# EAGLE design Speed Bag Counter-v10 (EAGLE 6.3)
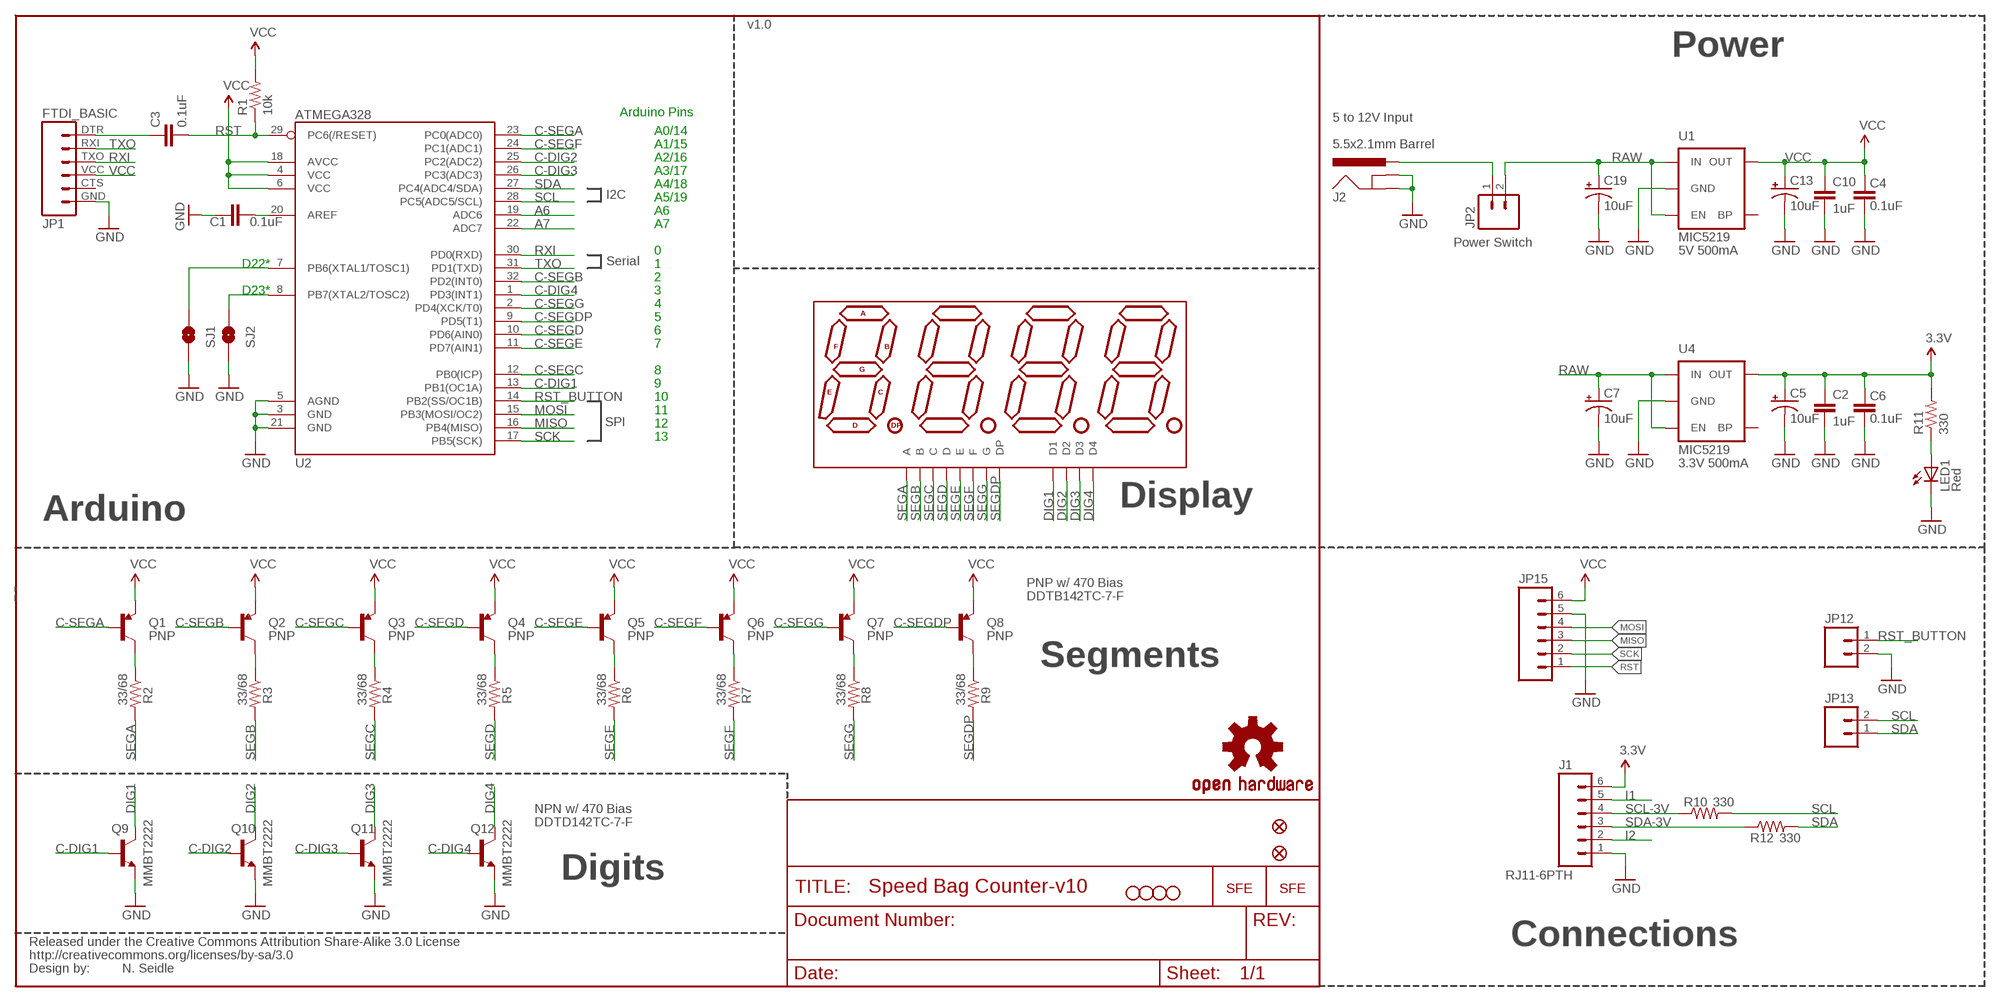
[diagram p0: schematic, sheet 1]

## Parts
C1  0.1uF  CAP0402-CAP  [0402-CAP]
C2  1uF  CAP0402-CAP  [0402-CAP]
C3  0.1uF  CAP0402-CAP  [0402-CAP]
C4  0.1uF  CAP0402-CAP  [0402-CAP]
C5  10uF  CAP_POL1206  [EIA3216]
C6  0.1uF  CAP0402-CAP  [0402-CAP]
C7  10uF  CAP_POL1206  [EIA3216]
C10  1uF  CAP0402-CAP  [0402-CAP]
C13  10uF  CAP_POL1206  [EIA3216]
C19  10uF  CAP_POL1206  [EIA3216]
J1  RJ11-6PTH  [RJ11-6]
J2  5.5x2.1mm Barrel  POWER_JACKSMD  [POWER_JACK_SMD]
JP1  FTDI_BASIC  FTDI_BASICPTH  [FTDI_BASIC]
JP2  M02-JST-2MM-SMT  [JST-2-SMD]
JP3  STAND-OFF  [STAND-OFF]
JP4  STAND-OFF  [STAND-OFF]
JP5  STAND-OFF  [STAND-OFF]
JP6  STAND-OFF  [STAND-OFF]
JP7  FIDUCIALUFIDUCIAL  [MICRO-FIDUCIAL]
JP12  M02-JST-2MM-SMT  [JST-2-SMD]
JP13  M02PTH  [1X02]
JP14  FIDUCIALUFIDUCIAL  [MICRO-FIDUCIAL]
JP15  M06SIP  [1X06]
LED1  Red  LED0603  [LED-0603]
Q1  PNP  TRANSISTOR_PNPSMD  [SOT23-3]
Q2  PNP  TRANSISTOR_PNPSMD  [SOT23-3]
Q3  PNP  TRANSISTOR_PNPSMD  [SOT23-3]
Q4  PNP  TRANSISTOR_PNPSMD  [SOT23-3]
Q5  PNP  TRANSISTOR_PNPSMD  [SOT23-3]
Q6  PNP  TRANSISTOR_PNPSMD  [SOT23-3]
Q7  PNP  TRANSISTOR_PNPSMD  [SOT23-3]
Q8  PNP  TRANSISTOR_PNPSMD  [SOT23-3]
Q9  MMBT2222  TRANSISTOR_NPNSOT23-3  [SOT23-3]
Q10  MMBT2222  TRANSISTOR_NPNSOT23-3  [SOT23-3]
Q11  MMBT2222  TRANSISTOR_NPNSOT23-3  [SOT23-3]
Q12  MMBT2222  TRANSISTOR_NPNSOT23-3  [SOT23-3]
R1  10k  RESISTOR0402-RES  [0402-RES]
R2  33/68  RESISTOR0402-RES  [0402-RES]
R3  33/68  RESISTOR0402-RES  [0402-RES]
R4  33/68  RESISTOR0402-RES  [0402-RES]
R5  33/68  RESISTOR0402-RES  [0402-RES]
R6  33/68  RESISTOR0402-RES  [0402-RES]
R7  33/68  RESISTOR0402-RES  [0402-RES]
R8  33/68  RESISTOR0402-RES  [0402-RES]
R9  33/68  RESISTOR0402-RES  [0402-RES]
R10  330  RESISTOR0402-RES  [0402-RES]
R11  330  RESISTOR0402-RES  [0402-RES]
R12  330  RESISTOR0402-RES  [0402-RES]
SJ1  Counter Ctl  SOLDERJUMPERNO  [SJ_2S-NO]
SJ2  Counter Ctl  SOLDERJUMPERNO  [SJ_2S-NO]
U1  MIC5219  V_REG_LDOSMD  [SOT23-5]
U2  ATMEGA328  ATMEGA168  [TQFP32-08]
U3  7-SEGMENT-4DIGIT-COUNTERPTH  [7-SEGMENT-4DIGIT-COUNTER]
U4  MIC5219  V_REG_LDOSMD  [SOT23-5]
U$2  LOGO-SFESK  [SFE-LOGO-FLAME]
U$3  CREATIVE_COMMONS  [CREATIVE_COMMONS]
U$4  OSHW-LOGOS  [OSHW-LOGO-S]
U$7  LOGO-SFENW2  [SFE-NEW-WEB]

## Nets
3.3V: C2.1 C5.A(+) C6.2 J1.6 R11.2 U4.5(OUT)
A6: U2.19(ADC6)
A7: U2.22(ADC7)
ANALOG: SJ2.1 U2.8(PB7(XTAL2/TOSC2))
C-DIG1: Q9.1(B) U2.13(PB1(OC1A))
C-DIG2: Q10.1(B) U2.25(PC2(ADC2))
C-DIG3: Q11.1(B) U2.26(PC3(ADC3))
C-DIG4: Q12.1(B) U2.1(PD3(INT1))
C-SEGA: Q1.1(B) U2.23(PC0(ADC0))
C-SEGB: Q2.1(B) U2.32(PD2(INT0))
C-SEGC: Q3.1(B) U2.12(PB0(ICP))
C-SEGD: Q4.1(B) U2.10(PD6(AIN0))
C-SEGDP: Q8.1(B) U2.9(PD5(T1))
C-SEGE: Q5.1(B) U2.11(PD7(AIN1))
C-SEGF: Q6.1(B) U2.24(PC1(ADC1))
C-SEGG: Q7.1(B) U2.2(PD4(XCK/T0))
COUNTER: SJ1.1 U2.7(PB6(XTAL1/TOSC1))
DIG1: Q9.3(C) U3.12(D1)
DIG2: Q10.3(C) U3.9(D2)
DIG3: Q11.3(C) U3.8(D3)
DIG4: Q12.3(C) U3.6(D4)
GND: C1.1 C2.2 C4.1 C5.C(-) C6.1 C7.C(-) C10.2 C13.C(-) C19.C(-) J1.1 J2.GND(GNDBREAK) J2.P$4(GND) JP1.GND JP12.2 JP15.5 LED1.C Q9.2(E) Q10.2(E) Q11.2(E) Q12.2(E) SJ1.2 SJ2.2 U1.2(GND) U2.3(GND) U2.5(AGND) U2.21(GND) U4.2(GND)
I1: J1.5
I2: J1.2
MISO: JP15.3 U2.16(PB4(MISO))
MOSI: JP15.4 U2.15(PB3(MOSI/OC2))
N$1: Q1.3(C) R2.1
N$2: J2.VIN0(PWR) JP2.1
N$3: C3.1 JP1.DTR
N$4: Q2.3(C) R3.1
N$5: Q3.3(C) R4.1
N$6: Q4.3(C) R5.1
N$7: Q5.3(C) R6.1
N$8: Q6.3(C) R7.1
N$9: Q7.3(C) R8.1
N$10: Q8.3(C) R9.1
N$11: C1.2 U2.20(AREF)
N$38: LED1.A R11.1
RAW [vcc]: C7.A(+) C19.A(+) JP2.2 U1.1(IN) U1.3(EN) U4.1(IN) U4.3(EN)
RST: C3.2 JP15.1 R1.1 U2.29(PC6(/RESET))
RST_BUTTON: JP12.1 U2.14(PB2(SS/OC1B))
RXI: JP1.TXO U2.30(PD0(RXD))
SCK: JP15.2 U2.17(PB5(SCK))
SCL: JP13.2 R10.2 U2.28(PC5(ADC5/SCL))
SCL-3V: J1.4 R10.1
SDA: JP13.1 R12.2 U2.27(PC4(ADC4/SDA))
SDA-3V: J1.3 R12.1
SEGA: R2.2 U3.11(A)
SEGB: R3.2 U3.7(B)
SEGC: R4.2 U3.4(C)
SEGD: R5.2 U3.2(D)
SEGDP: R9.2 U3.3(DP)
SEGE: R6.2 U3.1(E)
SEGF: R7.2 U3.10(F)
SEGG: R8.2 U3.5(G)
TXO: JP1.RXI U2.31(PD1(TXD))
VCC: C4.2 C10.1 C13.A(+) JP1.VCC JP15.6 Q1.2(E) Q2.2(E) Q3.2(E) Q4.2(E) Q5.2(E) Q6.2(E) Q7.2(E) Q8.2(E) R1.2 U1.5(OUT) U2.4(VCC) U2.6(VCC) U2.18(AVCC)
Unconnected: JP1.CTS U1.4(BP) U4.4(BP)

## Notes on the sheet
- v1.0
- Power
- Arduino Pins
- 5 to 12V Input
- A0/14
- A1/15
- A2/16
- A3/17
- A4/18
- I2C | A5/19
- A6
- A7
- Power Switch
- 0 | 5V 500mA
- D22* | Serial | 1
- 2
- D23* | 3
- 4
- 5
- 6
- 7
- 8
- 9
- 10
- 11
- SPI | 12
- 13
- 3.3V 500mA
- Display
- Arduino
- PNP w/ 470 Bias
- DDTB142TC-7-F
- Segments
- NPN w/ 470 Bias
- DDTD142TC-7-F
- Digits
- Connections
- N. Seidle

## Library data of the parts
C1-C4 C6 C10 = SparkFun:CAP: Capacitor Standard 0603 ceramic capacitor, and 0.1" leaded capacitor.
C5 C7 C13 C19 = SparkFun:CAP_POL: Capacitor Polarized These are standard SMD and PTH capacitors. Normally 10uF, 47uF, and 100uF in electrolytic and tantalum varieties. Always verify the external diameter of the through hole cap, it varies with capacity, voltage, and manufacturer. The EIA devices should be standard.
J1 = SparkFun-Connectors:RJ11-6: RJ11 Jack Simple 6 pin RJ11 jack. Commonly found on CAT3 devices and Microchip programmers. SKU: PRT-00132
J2 = SparkFun-Connectors:POWER_JACK: Power Jack This is the standard 5.5mm barrel jack for power. The PTH is the most common, proven, reliable, footprint. The Slot footprint only works if the mill layer is transmitted to the PCB fab house so be warned. Spark Fun Electronics SKU : PRT-00119 SMT: CONN-08106 Mating wall wart : TOL-00298 (and others); PROD_ID: CONN-08106
JP1 = SparkFun:FTDI_BASIC: FTDI Basic: 3.3V and 5V
JP2 JP12 JP13 = SparkFun-Connectors:M02: Header 2 Standard 2-pin 0.1" header. Use with straight break away headers (SKU : PRT-00116), right angle break away headers (PRT-00553), swiss pins (PRT-00743), machine pins (PRT-00117), and female headers (PRT-00115). Molex polarized connector foot print use with SKU : PRT-08233 with associated crimp pins and housings.
JP3-JP6 = SparkFun-Electromechanical:STAND-OFF: #4 Stand Off This is the mechanical footprint for a #4 phillips button head screw. Use the keepout ring to avoid running the screw head into surrounding components. SKU : PRT-00447
JP7 JP14 = SparkFun:FIDUCIAL: Fiducial Alignment Points Various fiducial points for machine vision alignment.
JP15 = SparkFun-Connectors:M06: Header 6 Standard 6-pin 0.1" header. Use with straight break away headers (SKU : PRT-00116), right angle break away headers (PRT-00553), swiss pins (PRT-00743), machine pins (PRT-00117), and female headers (PRT-00115). Molex polarized connector foot print use with SKU : PRT-08094 with associated crimp pins and housings. NOTES ON THE VARIANTS LOCK and LOCK_LONGPADS... This footprint was designed to help hold the alignment of a through-hole component (i.e. 6-pin header) while soldering it into place. You may notice that each hole has been shifted either up or down by 0.005 of an inch from it's more standard position (which is a perfectly straight line). This slight alteration caused the pins (the squares in the middle) to touch the edges of the holes. Because they are alternating, it causes a "brace" to hold the component in place. 0.005 has proven to be the perfect amount of "off-center" position when using our standard breakaway headers. Although looks a little odd when you look at the bare footprint, once you have a header in there, the alteration is very hard to notice. Also, if you push a header all the way into place, it is covered up entirely on the bottom side. This idea of altering the position of holes to aid alignment will be further integrated into the Sparkfun Library for other footprints. It can help hold any component with 3 or more connection pins.
LED1 = SparkFun:LED: LEDs Standard schematic elements and footprints for 5mm, 3mm, 1206, and 0603 sized LEDs. 5mm - Spark Fun Electronics SKU : COM-00529 (and others)
Q1-Q8 = SparkFun-DiscreteSemi:TRANSISTOR_PNP: Generic PNP BJT. Double check pinouts against datasheets- not all devices are the same!
Q9-Q12 = SparkFun-DiscreteSemi:TRANSISTOR_NPN: Generic NPN BJT. MMBT2222 is the common NPN we use. Double check against datasheet- not all devices are the same!
R1-R12 = SparkFun:RESISTOR: Resistor Basic schematic elements and footprints for 0603, 1206, and PTH resistors.
SJ1 SJ2 = SparkFun-Passives:SOLDERJUMPER: Solder Jumper Standard SMD solder jumper. Used to automate production. Two varients : Normally Open and Normally Closed are the same, but have different paste layers. NC will have a large amount of paste and should jumper during reflow.
U1 U4 = SparkFun:V_REG_LDO: Voltage Regulator LDO Standard 150mA LDO voltage regulator in SOT-23 layout. Micrel part MIC5205. BP (by-pass) pin is used to lower output noise with 470pF cap.
U2 = SparkFun-DigitalIC:ATMEGA168: Atmel 32-pin 8-bit micro, 16k flash.
U3 = SparkFun-Displays:7-SEGMENT-4DIGIT-COUNTER
U$2 U$7 = SparkFun:LOGO-SFE: Spark Fun Electronics PCB Logo This is the standard Spark Fun Electronics PCB logo.
U$3 = SparkFun:CREATIVE_COMMONS
U$4 = SparkFun-Aesthetics:OSHW-LOGO: Open Source Hardware Logo This logo indicates the piece of hardware it is found on incorporates a OSHW license and/or adheres to the definition of open source hardware found here: http://freedomdefined.org/OSHW

## Board
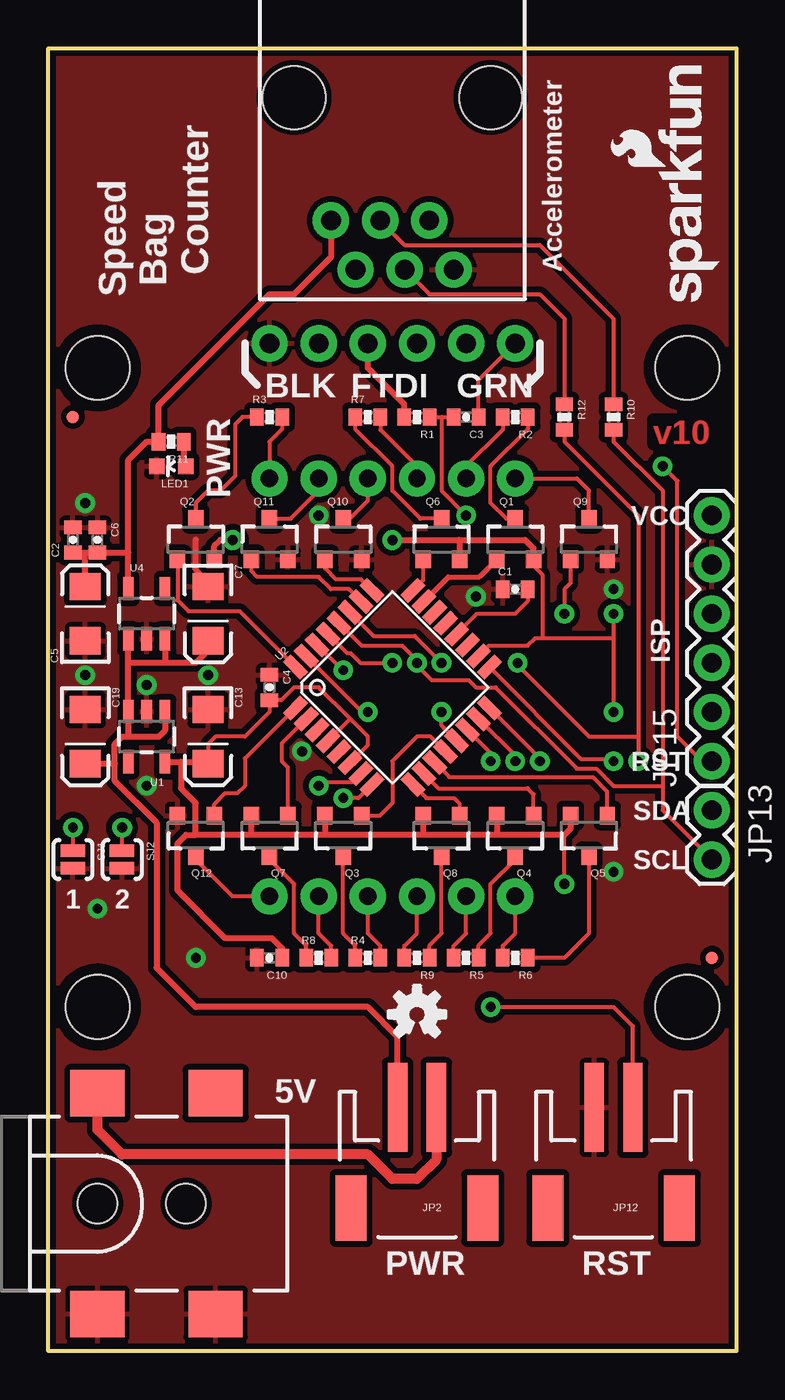
[diagram p1: board, top side]
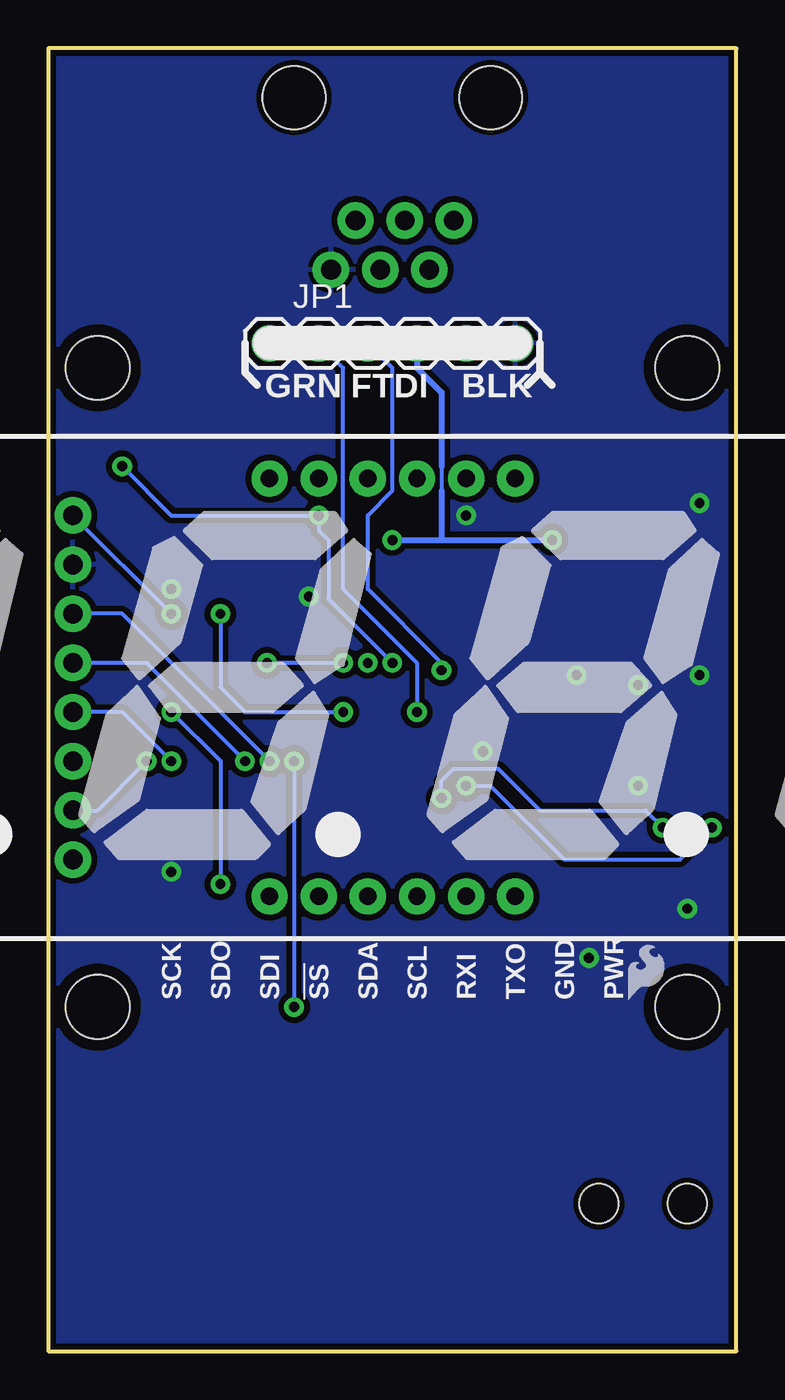
[diagram p2: board, bottom side, seen from below]

Size 35.56 x 67.31 mm. Coordinates in mm from the lower left corner, seen from the top.
Outline: 35.56,67.31 35.56,0 0,0 0,67.31 35.56,67.31
Copper layers (1*16): Top 0.035mm / dielectric 1.5mm / Bottom 0.035mm
Design rules "default": minimum track width 8mil, minimum drill 20mil, track to track 8mil, track to pad 8mil, pad to pad 8mil, via to via 8mil, smd to smd 8mil, copper to edge 10mil, drill to drill 8mil, minimum pad ring 12mil, minimum via ring 10mil, stop-mask expansion 4mil, vias tented up to drill 20mil, thermal gap 10mil

### Footprints (pad centres in the part's own frame; a part is rotated, then mirrored left to right if it is on the bottom)
0402-CAP = smd 0.7 x 0.9: 1 -0.65,0; 2 0.65,0
EIA3216 = smd 1.4 x 1.6: A 1.4,0; C -1.4,0
RJ11-6 = drill 1.016 pad 1.88: 1 1.905,8.89; 2 3.175,6.35; 3 4.445,8.89; 4 5.715,6.35; 5 6.985,8.89; 6 8.255,6.35 | hole 3.251: 0,0; 10.16,0
POWER_JACK_SMD = smd 2.8 x 2.4: GND 0,-5.7; P$4 6.1,-5.7; VIN0 0,5.7; VIN1 6.1,5.7 | hole 2.032: 0,0; 4.572,0
FTDI_BASIC = drill 1.016 pad 1.88: CTS 10.16,0; DTR 0,0; GND 12.7,0; RXI 2.54,0; TXO 5.08,0; VCC 7.62,0
JST-2-SMD = smd 1 x 4.6: 1 -1,-3.7; 2 1,-3.7 | smd 1.6 x 3.4: NC1 -3.4,1.5; NC2 3.4,1.5
STAND-OFF = hole 3.302: 0,0
MICRO-FIDUCIAL = smd 0.635 x 0.635: 1 0,0
1X02 = drill 1.016 pad 1.88: 1 0,0; 2 2.54,0
1X06 = drill 1.016 pad 1.88: 1 0,0; 2 2.54,0; 3 5.08,0; 4 7.62,0; 5 10.16,0; 6 12.7,0
LED-0603 = smd 0.8 x 0.8: A 0,-0.75; C 0,0.75
SOT23-3 = smd 0.8 x 0.9: 1 -0.95,-1; 2 0.95,-1; 3 0,1.1
0402-RES = smd 0.7 x 0.9: 1 -0.65,0; 2 0.65,0
SJ_2S-NO = smd 0.635 x 1.27: 1 -0.45,0; 2 0.45,0
SOT23-5 = smd 0.55 x 1.2: 1 -0.95,-1.3; 2 0,-1.3; 3 0.95,-1.3; 4 0.95,1.3; 5 -0.95,1.3
TQFP32-08 = smd 1.27 x 0.559: 1 -4.293,2.8; 2 -4.293,2; 3 -4.293,1.2; 4 -4.293,0.4; 5 -4.293,-0.4; 6 -4.293,-1.2; 7 -4.293,-2; 8 -4.293,-2.8; 17 4.293,-2.8; 18 4.293,-2; 19 4.293,-1.2; 20 4.293,-0.4; 21 4.293,0.4; 22 4.293,1.2; 23 4.293,2; 24 4.293,2.8 | smd 0.559 x 1.27: 9 -2.8,-4.293; 10 -2,-4.293; 11 -1.2,-4.293; 12 -0.4,-4.293; 13 0.4,-4.293; 14 1.2,-4.293; 15 2,-4.293; 16 2.8,-4.293; 25 2.8,4.293; 26 2,4.293; 27 1.2,4.293; 28 0.4,4.293; 29 -0.4,4.293; 30 -1.2,4.293; 31 -2,4.293; 32 -2.8,4.293
7-SEGMENT-4DIGIT-COUNTER = drill 0.9 pad 1.88: 1 -6.35,-10.795; 2 -3.81,-10.795; 3 -1.27,-10.795; 4 1.27,-10.795; 5 3.81,-10.795; 6 6.35,-10.795; 7 6.35,10.795; 8 3.81,10.795; 9 1.27,10.795; 10 -1.27,10.795; 11 -3.81,10.795; 12 -6.35,10.795

### Placement (x,y rotation side)
C1  24.13,39.37 0 top
C2  1.27,41.91 90 top
C3  21.59,48.26 180 top
C4  11.43,34.29 270 top
C5  1.91,38.1 90 top
C6  2.54,41.91 270 top
C7  8.26,38.1 270 top
C10  11.43,20.32 180 top
C13  8.26,31.75 270 top
C19  1.91,31.75 270 top
J1  22.86,64.77 180 top
J2  2.54,7.62 0 top
JP1  24.13,52.07 0 bottom
JP2  19.05,8.89 180 top
JP3  33.02,50.8 0 top
JP4  2.54,50.8 0 top
JP5  33.02,17.78 0 top
JP6  2.54,17.78 0 top
JP7  1.27,48.26 0 top
JP12  29.21,8.89 180 top
JP13  34.29,27.94 270 top
JP14  34.29,20.32 0 top
JP15  34.29,30.48 90 top
LED1  6.35,45.72 90 top
Q1  24.13,41.91 0 top
Q2  7.62,41.91 0 top
Q3  15.24,26.67 180 top
Q4  24.13,26.67 180 top
Q5  27.94,26.67 180 top
Q6  20.32,41.91 0 top
Q7  11.43,26.67 180 top
Q8  20.32,26.67 180 top
Q9  27.94,41.91 0 top
Q10  15.24,41.91 0 top
Q11  11.43,41.91 0 top
Q12  7.62,26.67 180 top
R1  19.05,48.26 180 top
R2  24.13,48.26 180 top
R3  11.43,48.26 0 top
R4  16.51,20.32 0 top
R5  21.59,20.32 180 top
R6  24.13,20.32 180 top
R7  16.51,48.26 0 top
R8  13.97,20.32 0 top
R9  19.05,20.32 180 top
R10  29.21,48.26 270 top
R11  6.35,46.99 180 top
R12  26.67,48.26 270 top
SJ1  1.27,25.4 270 top
SJ2  3.81,25.4 270 top
U1  5.08,31.75 180 top
U2  17.78,34.29 45 top
U3  17.78,34.29 0 bottom
U4  5.08,38.1 0 top
U$1  LOGO-SFESK  [SFE-LOGO-FLAME]  5.59,18.16 0 bottom
U$2  31.88,61.21 90 top
U$3  -8.89,-10.16 0 top  (outside the outline)
U$4  19.05,17.4 0 top
U$7  34.67,54.23 90 top

### Tracks (layer width: path | path; a pad name or v marks a point on that pad's centre or on a via)
3.3V
  Top 0.203: 4.12,41.26 4.13,41.27
  Top 0.305: U4.5 4.13,41.27 4.13,46.04 5.08,46.99 R11.2 5.7,48.88 11.43,54.61 12.7,54.61 14.61,56.52 J1.6 | 4.12,41.26 C6.2 1.91,41.26 | C2.1 1.91,41.26 | C5.A 1.91,41.26
ANALOG  (via drill 0.51)
  Top 0.203: SJ2.1 v3.81,27.05 | U2.8 16.03,28.57 v15.24,28.57
  Bottom 0.203: v15.24,28.57 15.24,29.46 14.61,30.1 12.32,30.1 10.16,27.94 4.7,27.94 v3.81,27.05
C-DIG1  (via drill 0.51)
  Top 0.203: U2.13 20.32,32.32 v20.32,33.02 | Q9.1 26.99,39.69 26.67,39.37 v26.67,38.1
  Bottom 0.203: v26.67,38.1 26.67,34.29 25.4,33.02 v20.32,33.02
C-DIG2
  Top 0.203: U2.25 16.15,39.88 14.86,39.88 14.29,40.45 Q10.1
C-DIG3
  Top 0.203: U2.26 15.53,39.37 14.61,39.37 13.97,40 10.8,40 10.48,40.32 Q11.1
C-DIG4
  Top 0.203: U2.1 10.16,30.63 10.16,29.21 9.78,28.83 9.14,28.83 8.57,28.25 Q12.1
C-SEGA
  Top 0.254: U2.23 20.67,40 22.28,40 Q1.1
C-SEGB
  Top 0.203: Q2.1 6.67,38.8 7.24,38.23 9.88,38.23 U2.32
C-SEGC
  Top 0.203: U2.12 19.75,31.75 19.05,31.75 17.78,30.48 17.78,28.32 17.13,27.67 Q3.1
C-SEGD
  Top 0.203: U2.10 20.16,29.08 24.77,29.08 25.08,28.77 Q4.1
C-SEGDP
  Top 0.203: U2.9 19.54,28.57 20.96,28.57 21.27,28.26 Q8.1
C-SEGE
  Top 0.203: U2.11 20.72,29.65 28.13,29.65 28.89,28.89 Q5.1
C-SEGF
  Top 0.203: U2.24 19.37,39.84 Q6.1
C-SEGG
  Top 0.203: U2.2 12.07,31.4 12.07,30.48 12.38,30.16 Q7.1
COUNTER  (via drill 0.51)
  Top 0.203: U2.7 15.71,29.39 14.15,29.39 v13.97,29.21 | v1.27,27.05 SJ1.1
  Bottom 0.203: v13.97,29.21 12.7,29.21 8.89,25.4 2.92,25.4 v1.27,27.05
DIG1
  Top 0.203: Q9.3 27.94,44.45 27.3,45.09 U3.12
DIG2
  Top 0.203: Q10.3 15.58,43.01 16.51,43.94 U3.9
DIG3
  Top 0.203: Q11.3 12.53,43.01 13.97,44.45 U3.8
DIG4
  Top 0.203: Q12.3 7.62,25.4 9.53,23.49 U3.6
GND  (via drill 0.51)
  Top 0.305: C7.C 8.26,39.75 7.62,40.39 7.62,41.91
  other vias: 22.1,38.99 29.21,39.37 29.21,24.77 2.54,22.86 7.62,20.32 13.11,30.99 8.26,34.92 5.08,29.21 1.91,34.92 13.97,43.18 5.08,34.42 1.91,43.81
  pour Top (isolate 0.305): 0,0 0,67.31 35.56,67.31 35.56,0
  pour Bottom (isolate 0.305): 0,0 0,67.31 35.56,67.31 35.56,0
MISO  (via drill 0.51)
  Top 0.203: U2.16 25.4,30.63 v25.4,30.48
  Bottom 0.203: v25.4,30.48 30.48,35.56 JP15.3
MOSI  (via drill 0.51)
  Top 0.203: U2.15 24.13,30.77 v24.13,30.48
  Bottom 0.203: v24.13,30.48 31.75,38.1 JP15.4
N$1
  Top 0.203: Q1.3 23.66,43.01 22.86,43.81 22.86,45.72 24.78,47.64 R2.1
N$2
  Top 0.508: JP2.1 20.05,9.89 19.05,8.89 17.78,8.89 16.51,10.16 3.81,10.16 2.54,11.43 J2.VIN0
N$3
  Top 0.203: C3.1 22.24,50.18 JP1.DTR
N$4
  Top 0.203: R3.1 10.03,48.26 9.65,47.88 9.65,45.21 8.89,44.45 8.26,44.45 7.62,43.81 Q2.3
N$5
  Top 0.203: R4.1 15.86,20.97 15.24,21.59 Q3.3
N$6
  Top 0.203: R5.1 22.24,20.97 22.86,21.59 22.86,24.13 24.13,25.4 Q4.3
N$7
  Top 0.203: Q5.3 27.94,21.59 26.67,20.32 R6.1
N$8
  Top 0.203: Q6.3 19.22,43.01 17.78,44.45 17.78,45.72 15.86,47.64 R7.1
N$9
  Top 0.203: R8.1 13.32,20.97 12.7,21.59 12.7,24.13 11.43,25.4 Q7.3
N$10
  Top 0.203: R9.1 19.7,20.97 20.32,21.59 Q8.3
N$11
  Top 0.203: C1.2 24.78,38.75 24.13,38.1 22.16,38.1 U2.20
N$38
  Top 0.305: R11.1 7,45.82 LED1.A
RAW
  Top 0.305: 3.43,30.35 3.43,29.46 5.59,27.3 5.59,19.81 7.62,17.78 16.51,17.78 18.05,16.24 JP2.2 | 3.43,30.35 3.43,31.37 3.81,31.75 4.19,31.75 | C19.A 3.43,30.35 | 4.19,31.75 5.72,31.75 6.03,32.06 U1.1 | 4.19,31.75 4.13,31.81 U1.3 4.13,35.56 | 4.13,35.56 U4.1 | C7.A 8.26,36.2 7.62,35.56 6.1,35.56 | 6.1,35.56 4.13,35.56 | U4.3 6.03,35.63 6.1,35.56
RST  (via drill 0.51)
  Top 0.203: R1.1 20.32,48.26 | 20.32,48.26 C3.2 | 20.32,48.26 20.32,44.45 v21.59,43.18 | U2.29 15.44,36.07 15.62,36.07 16.13,35.56 v17.78,35.56 | JP15.1 33.78,30.48 32.51,31.75 32.51,44.96 v31.75,45.72
  Bottom 0.203: v17.78,35.56 21.08,38.86 21.08,41.91 21.59,42.42 v21.59,43.18 29.21,43.18 v31.75,45.72
RST_BUTTON  (via drill 0.51)
  Top 0.203: U2.14 22.86,30.91 v22.86,30.48 | v22.86,17.78 29.21,17.78 30.21,16.78 JP12.1
  Bottom 0.203: v22.86,30.48 v22.86,17.78
RXI  (via drill 0.51)
  Top 0.203: U2.30 15.19,35.18 v15.24,35.18
  Bottom 0.203: v15.24,35.18 15.24,35.56 19.05,39.37 19.05,43.18 17.78,44.45 17.78,50.8 JP1.TXO
SCK  (via drill 0.51)
  Top 0.203: U2.17 27.53,30.61 29.08,30.61 v29.21,30.48
  Bottom 0.203: v29.21,30.48 31.75,33.02 JP15.2
SCL  (via drill 0.51)
  Top 0.203: U2.28 16.19,36.45 18.29,36.45 19.05,35.69 v19.05,35.56 19.05,35.43 19.81,34.67 21.72,34.67 22.1,34.29 23.11,34.29 27.3,30.1 28.32,30.1 29.21,29.21 31.75,29.21 | R10.2 29.21,46.99 31.75,44.45 31.75,29.21 | 31.75,29.21 31.75,27.94 JP13.2
SCL-3V
  Top 0.203: J1.4 18.42,57.15 25.4,57.15 29.21,53.34 R10.1
SDA  (via drill 0.51)
  Top 0.203: U2.27 16.81,36.96 18.92,36.96 v20.32,35.56 | 30.48,31.75 30.48,43.18 26.67,46.99 R12.2 | 30.48,31.75 v30.48,30.48 | v24.26,35.56 24.26,35.43 27.94,31.75 30.48,31.75
  Bottom 0.203: v20.32,35.56 v24.26,35.56 | JP13.1 33.02,27.94 v30.48,30.48
SDA-3V
  Top 0.203: J1.3 19.69,54.61 25.4,54.61 26.67,53.34 R12.1
SEGA
  Top 0.203: U3.11 21.59,45.72 23.48,47.61 R2.2
SEGB
  Top 0.203: R3.2 12.08,47.64 11.43,46.99 U3.7
SEGC
  Top 0.203: R4.2 17.16,20.94 16.51,21.59 U3.4
SEGD
  Top 0.203: R5.2 20.94,20.94 21.59,21.59 U3.2
SEGDP
  Top 0.203: R9.2 18.4,20.94 19.05,21.59 U3.3
SEGE
  Top 0.203: R6.2 23.48,20.94 24.13,21.59 U3.1
SEGF
  Top 0.203: R7.2 17.16,47.61 19.05,45.72 U3.10
SEGG
  Top 0.203: R8.2 14.62,20.94 13.97,21.59 U3.5
TXO  (via drill 0.51)
  Top 0.203: U2.31 16.22,33.02 v16.51,33.02
  Bottom 0.203: v16.51,33.02 16.51,35.56 20.32,39.37 20.32,50.8 JP1.RXI
VCC  (via drill 0.51)
  Top 0.203: U2.4 15.56,32.63 15.56,32.7 | U2.6 16.51,31.32 16.51,31.75 15.56,32.7 | 15.56,32.7 13.97,34.29 12.7,34.29 12.05,33.64 C4.2 11.43,33.02 10.16,31.75 8.64,31.75 8.26,31.37 C13.A | U2.18 22.77,36.45 24.77,36.45 25.15,36.83 25.53,36.83 | Q1.2 25.08,40.58 25.53,40.13 25.53,36.83 | 29.21,36.83 25.53,36.83 | v29.21,38.1 29.21,36.83 | 29.21,36.83 v29.21,33.02 | v26.67,24.13 26.67,26.67
  Top 0.305: 21.21,41.91 24.64,41.91 25.08,41.47 Q1.2 | C13.A 7.62,30.35 7.52,30.45 6.86,30.45 | R1.2 18.4,48.91 16.51,50.8 JP1.VCC | U1.5 6.86,30.45 | C10.1 12.08,20.81 11.56,21.34 9.14,21.34 6.67,23.81 6.67,26.23 7.11,26.67 7.62,26.67 | Q6.2 21.27,41.85 21.21,41.91 | Q5.2 26.99,26.99 26.67,26.67 23.11,26.67 | 23.11,26.67 19.43,26.67 | 19.43,26.67 14.22,26.67 | 14.22,26.67 10.54,26.67 | 10.54,26.67 7.62,26.67 | Q7.2 10.48,26.73 10.54,26.67 | Q3.2 14.29,26.74 14.22,26.67 | Q8.2 19.37,26.73 19.43,26.67 | Q4.2 23.18,26.74 23.11,26.67 | 7.62,26.67 7.62,28.32 6.86,29.08 6.86,30.45 | v17.78,41.91 21.21,41.91 | Q2.2 8.57,41.59 8.89,41.91 v9.53,41.91
  Bottom 0.203: 15.24,45.72 15.24,44.45 | JP15.6 v29.21,38.1 | v29.21,33.02 26.67,30.48 v26.67,24.13
  Bottom 0.305: JP1.VCC 16.51,50.8 15.24,49.53 15.24,45.72 | v17.78,41.91 15.24,41.91 | 15.24,41.91 v9.53,41.91 | 15.24,44.45 15.24,41.91

### Text on the board
Top: v10
tPlace: Accelerometer | Speed / Bag / Counter | BLK | FTDI | GRN | PWR | VCC | ISP | RST | SDA | SCL | 1 | 2 | 5V | PWR | RST | N. Seidle
bPlace: BLK | FTDI | GRN | PWR | GND | TXO | RXI | SCL | SDA | !SS | SDI | SDO | SCK
Measures: 1.20 | 0.15 | 1.30 | 1.50 | 1.0236 | 0.7173 | All dimensions are in inches. | 1.40